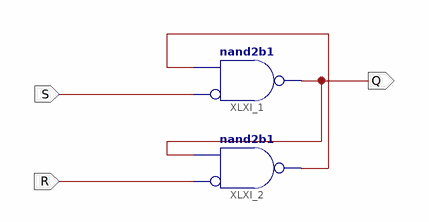
[diagram p0: schematic sheet 1]
// Xilinx ISE schematic Scheme.sch (spartan6) as structural Verilog: 2 symbols, 3 ports
module Scheme (
  input  S,
  input  R,
  output Q
);

  wire XLXN_10;

  nand XLXI_2 (XLXN_10, ~R, Q);  // nand2b1
  nand XLXI_1 (Q, ~S, XLXN_10);  // nand2b1
endmodule
